# EAGLE design Tree_Batt (EAGLE 6.5.0)
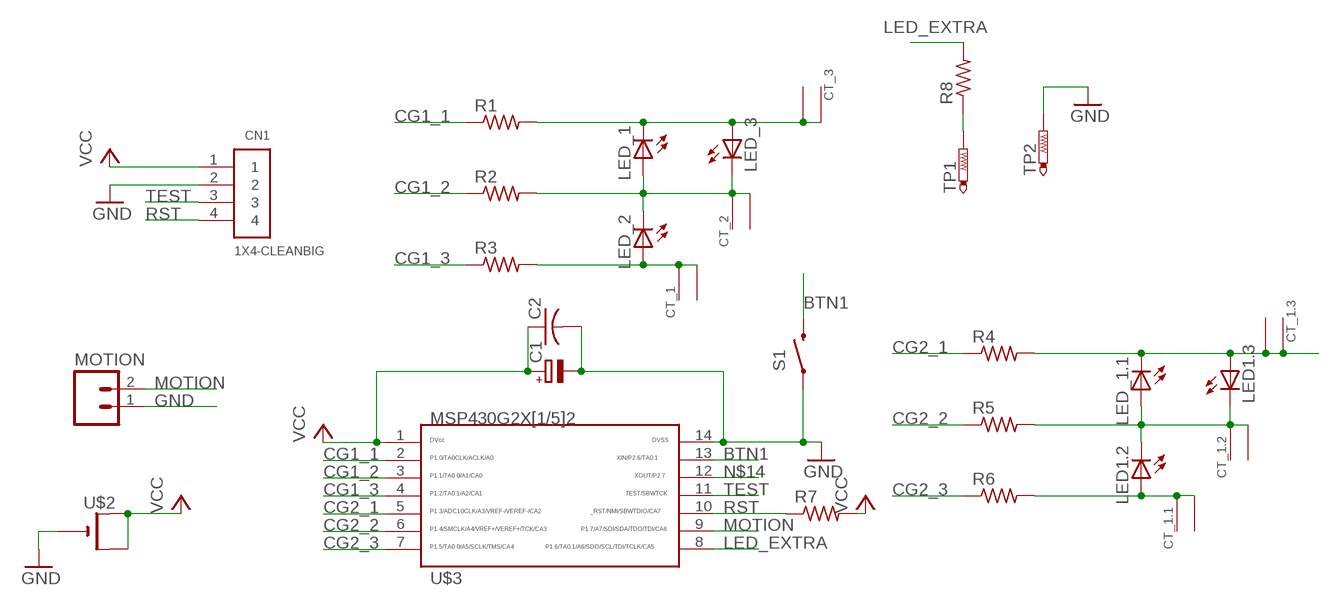
[diagram p0: schematic, sheet 1]

## Parts
C1  CPOL-EUE2,5-6E  [E2,5-6E]
C2  C-US025-024X044  [C025-024X044]
CN1  1X4-CLEANBIG  [1X04-CLEANBIG]
CT_1  SMD_PAD  [5X5TREEPAD]
CT_1.1  SMD_PAD  [5X5TREEPAD]
CT_1.2  SMD_PAD  [5X5TREEPAD]
CT_1.3  SMD_PAD  [5X5TREEPAD]
CT_2  SMD_PAD  [5X5TREEPAD]
CT_3  SMD_PAD  [5X5TREEPAD]
LED1.2  LEDLED_CLEAN_EDGE  [1X02_NO_SILK]
LED1.3  LEDLED_CLEAN_EDGE  [1X02_NO_SILK]
LED_1  LEDLED_CLEAN_EDGE  [1X02_NO_SILK]
LED_1.1  LEDLED_CLEAN_EDGE  [1X02_NO_SILK]
LED_2  LEDLED_CLEAN_EDGE  [1X02_NO_SILK]
LED_3  LEDLED_CLEAN_EDGE  [1X02_NO_SILK]
MOTION  M021X02_NO_SILK  [1X02_NO_SILK]
R1  R-US_0204/7  [0204/7]
R2  R-US_0204/7  [0204/7]
R3  R-US_0204/7  [0204/7]
R4  R-US_0204/7  [0204/7]
R5  R-US_0204/7  [0204/7]
R6  R-US_0204/7  [0204/7]
R7  R-US_0204/7  [0204/7]
R8  R-US_0204/7  [0204/7]
S1  SWITCH-MOMENTARY-2-SMD-1101NE  [TACTILE-SWITCH-1101NE]
TP1  PTR1PAD1-13  [P1-13]
TP2  PTR1PAD1-13  [P1-13]
U$2  CR2032SMT  [CR2032-SMD]
U$3  G2X[1/5]2---PW14  [PW14]

## Nets
BTN1: S1.P$2 U$3.13
CG1_1: R1.1 U$3.2
CG1_2: R2.1 U$3.3
CG1_3: R3.1 U$3.4
CG2_1: R4.1 U$3.5
CG2_2: R5.1 U$3.6
CG2_3: R6.1 U$3.7
GND: C1.- C2.2 CN1.2 MOTION.1 S1.P$1 TP2.TP U$2.- U$3.14
LED_EXTRA: R8.2 U$3.8
MOTION: MOTION.2 U$3.9
N$1: CT_1.P$1 CT_1.P$2 LED_2.1(A) R3.2
N$2: CT_2.P$1 CT_2.P$2 LED_1.1(A) LED_2.2(C) LED_3.2(C) R2.2
N$3: CT_3.P$1 CT_3.P$2 LED_1.2(C) LED_3.1(A) R1.2
N$4: R8.1 TP1.TP
N$5: CT_1.2.P$1 CT_1.2.P$2 LED1.2.2(C) LED1.3.2(C) LED_1.1.1(A) R5.2
N$6: CT_1.3.P$1 CT_1.3.P$2 LED1.3.1(A) LED_1.1.2(C) R4.2
N$7: CT_1.1.P$1 CT_1.1.P$2 LED1.2.1(A) R6.2
N$14: U$3.12
RST: CN1.4 R7.1 U$3.10
TEST: CN1.3 U$3.11
VCC: C1.+ C2.1 CN1.1 R7.2 U$2.+$1(+) U$2.+$2(+1) U$3.1

## Library data of the parts
C1 = rcl:CPOL-EU: POLARIZED CAPACITOR, European symbol
C2 = rcl:C-US: CAPACITOR, American symbol
CN1 = BergCustom:1X4: 4-pin connector
CT_1 CT_1.1-CT_1.3 CT_2 CT_3 = Christmas2014Custom:SMD_PAD
LED1.2 LED1.3 LED_1 LED_1.1 LED_2 LED_3 = BergCustom:LED: LED OSRAM: - CHIPLED LG R971, LG N971, LY N971, LG Q971, LY Q971, LO R971, LY R971 LH N974, LH R974 LS Q976, LO Q976, LY Q976 LO Q996 - Hyper CHIPLED LW Q18S LB Q993, LB Q99A, LB R99A - SideLED LS A670, LO A670, LY A670, LG A670, LP A670 LB A673, LV A673, LT A673, LW A673 LH A674 LY A675 LS A676, LA A676, LO A676, LY A676, LW A676 LS A679, LY A679, LG A679 - Hyper Micro SIDELED® LS Y876, LA Y876, LO Y876, LY Y876 LT Y87S - SmartLED LW L88C, LW L88S LB L89C, LB L89S, LG L890 LS L89K, LO L89K, LY L89K LS L896, LA L896, LO L896, LY L896 - TOPLED LS T670, LO T670, LY T670, LG T670, LP T670 LSG T670, LSP T670, LSY T670, LOP T670, LYG T670 LG T671, LOG T671, LSG T671 LB T673, LV T673, LT T673, LW T673 LH T674 LS T676, LA T676, LO T676, LY T676, LB T676, LH T676, LSB T676, LW T676 LB T67C, LV T67C, LT T67C, LS T67K, LO T67K, LY T67K, LW E67C LS E67B, LA E67B, LO E67B, LY E67B, LB E67C, LV E67C, LT E67C LW T67C LS T679, LY T679, LG T679 LS T770, LO T770, LY T770, LG T770, LP T770 LB T773, LV T773, LT T773, LW T773 LH T774 LS E675, LA E675, LY E675, LS T675 LS T776, LA T776, LO T776, LY T776, LB T776 LHGB T686 LT T68C, LB T68C - Hyper Mini TOPLED® LB M676 - Mini TOPLED Santana® LG M470 LS M47K, LO M47K, LY M47K Source: http://www.osram.convergy.de LUXEON: - LUMILED® LXK2-PW12-R00, LXK2-PW12-S00, LXK2-PW14-U00, LXK2-PW14-V00 LXK2-PM12-R00, LXK2-PM12-S00, LXK2-PM14-U00 LXK2-PE12-Q00, LXK2-PE12-R00, LXK2-PE12-S00, LXK2-PE14-T00, LXK2-PE14-U00 LXK2-PB12-K00, LXK2-PB12-L00, LXK2-PB12-M00, LXK2-PB14-N00, LXK2-PB14-P00, LXK2-PB14-Q00 LXK2-PR12-L00, LXK2-PR12-M00, LXK2-PR14-Q00, LXK2-PR14-R00 LXK2-PD12-Q00, LXK2-PD12-R00, LXK2-PD12-S00 LXK2-PH12-R00, LXK2-PH12-S00 LXK2-PL12-P00, LXK2-PL12-Q00, LXK2-PL12-R00 Source: www.luxeon.com KINGBRIGHT: KA-3528ASYC Source: www.kingbright.com
MOTION = BergCustom:M02: Header 2 Standard 2-pin 0.1" header. Use with straight break away headers (SKU : PRT-00116), right angle break away headers (PRT-00553), swiss pins (PRT-00743), machine pins (PRT-00117), and female headers (PRT-00115). Molex polarized connector foot print use with SKU : PRT-08233 with associated crimp pins and housings.
R1-R8 = rcl:R-US_: RESISTOR, American symbol
S1 = Sparkfun:SWITCH-MOMENTARY-2
TP1 TP2 = testpad:PTR1: TEST PIN
U$2 = adafruit:CR2032
U$3 = TI_MSP430_v16:G2X[1/5]2---PW14: MSP430G2X[1/5]2 MSP430G2x52, MSP430G2x12 TSSOP (PW) 14 Pin Package http://focus.ti.com/docs/prod/folders/print/msp430g2452.html

## Board
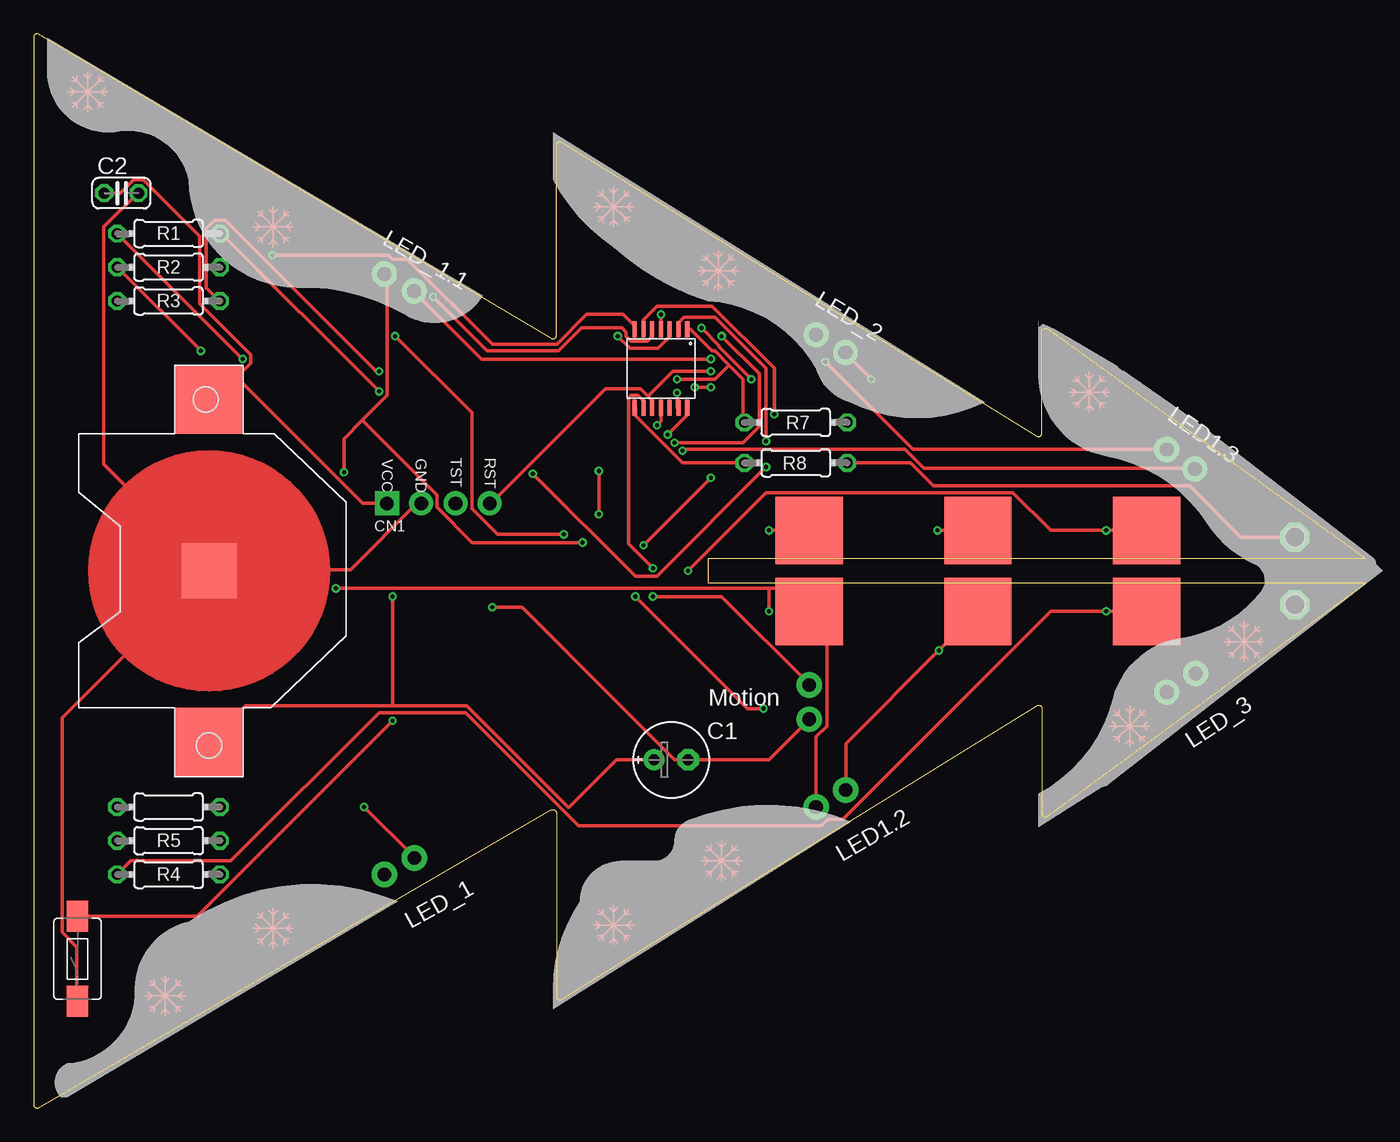
[diagram p1: board, top side]
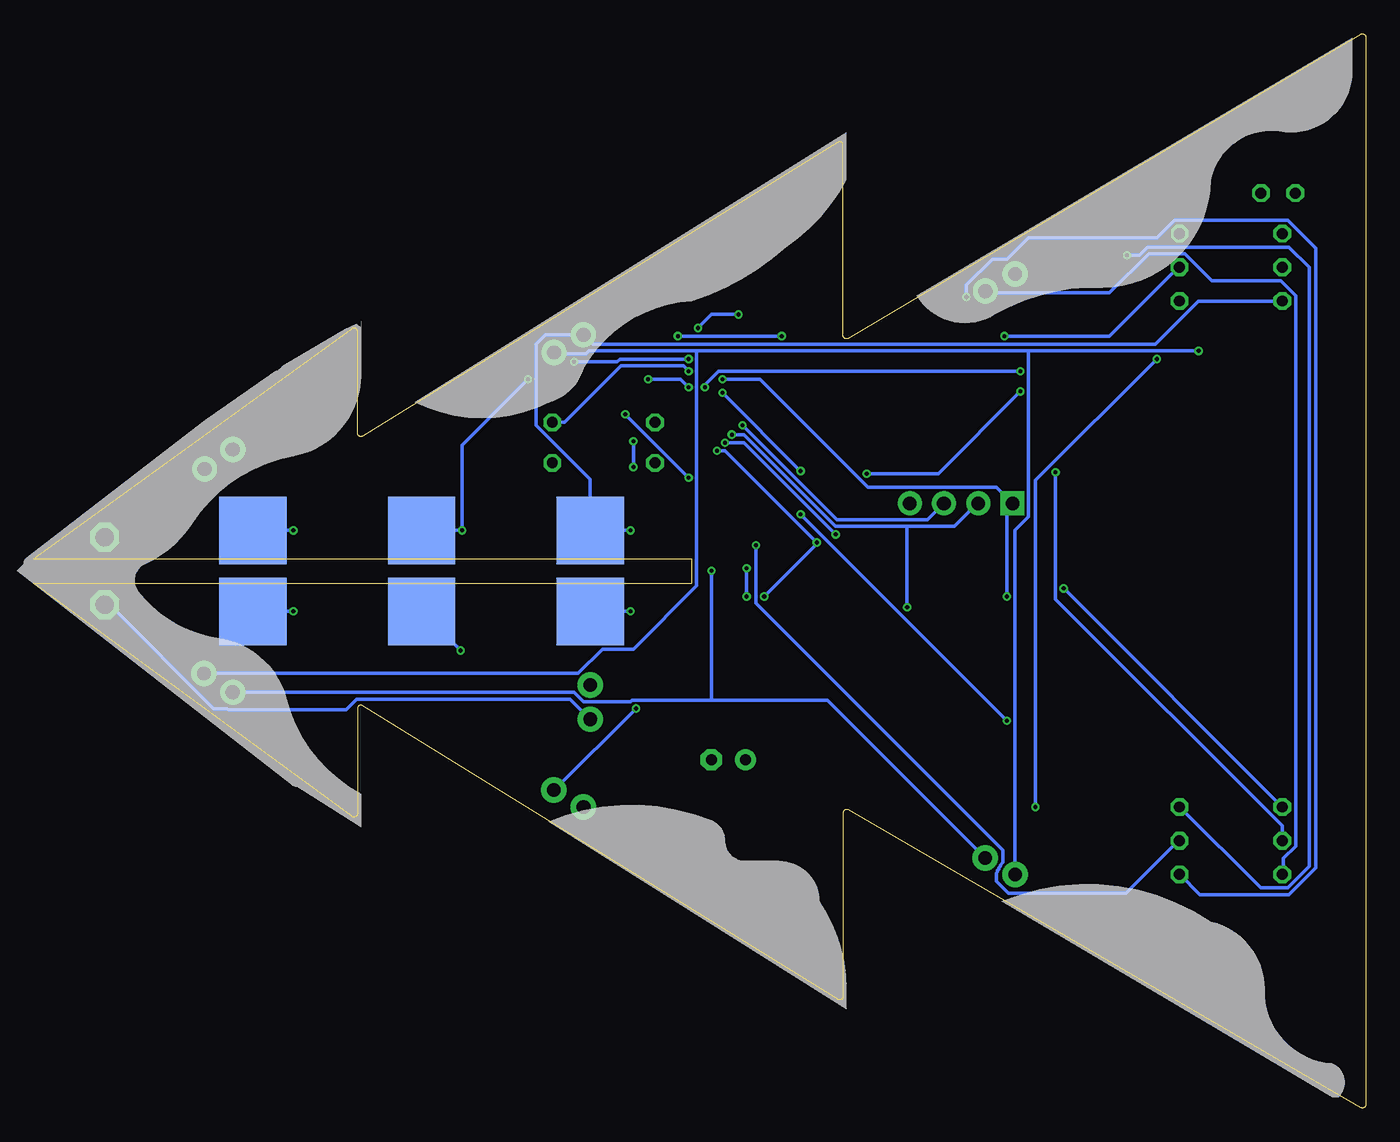
[diagram p2: board, bottom side, seen from below]

Size 98.75 x 79.62 mm. Coordinates in mm from the lower left corner, seen from the top.
Copper layers (1*16): Top 0.035mm / dielectric 1.5mm / Bottom 0.035mm
Design rules "Elecrow_2-layer_eagle_rule *": minimum track width 10mil, minimum drill 12mil, track to track 6mil, track to pad 6mil, pad to pad 6mil, via to via 6mil, smd to smd 0mil, copper to edge 10mil, drill to drill 10mil, minimum pad ring 10mil, minimum via ring 6mil, stop-mask expansion 2mil, vias tented up to drill 100mil, thermal gap 10mil

### Footprints (pad centres in the part's own frame; a part is rotated, then mirrored left to right if it is on the bottom)
E2,5-6E = drill 0.813 pad 1.575: + -1.27,0 | drill 0.813 pad 1.575 octagon: - 1.27,0
C025-024X044 = drill 0.813 octagon: 1 -1.27,0; 2 1.27,0
1X04-CLEANBIG = drill 1.016 pad 1.778 square: 1 -3.81,0 | drill 1.016 pad 1.778: 2 -1.27,0; 3 1.27,0; 4 3.81,0
5X5TREEPAD = smd 5 x 5: P$1 0,0 | smd 5 x 5 bottom: P$2 0,0
1X02_NO_SILK = drill 1.016 pad 1.88: 1 0,0; 2 2.54,0
0204/7 = drill 0.813 octagon: 1 -3.81,0; 2 3.81,0
TACTILE-SWITCH-1101NE = smd 2.3 x 1.6: P$1 -3.15,0; P$2 3.15,0
P1-13 = drill 1.321 pad 2.159 octagon: TP 0,0
CR2032-SMD = smd 5.08 x 5.08: +$1 -12.7,0; +$2 12.7,0 | smd 4.064 x 4.064: - 0,0
PW14 = smd 0.3 x 1.2: 1 -1.95,-2.9; 2 -1.3,-2.9; 3 -0.65,-2.9; 4 0,-2.9; 5 0.65,-2.9; 6 1.3,-2.9; 7 1.95,-2.9; 8 1.95,2.9; 9 1.3,2.9; 10 0.65,2.9; 11 0,2.9; 12 -0.65,2.9; 13 -1.3,2.9; 14 -1.95,2.9

### Placement (x,y rotation side)
C1  47.25,25.81 0 top
C2  6.5,67.81 0 top
CN1  30,44.81 0 top
CT_1  57.5,42.81 0 top
CT_1.1  57.5,36.81 0 top
CT_1.2  70,36.81 0 top
CT_1.3  82.5,36.81 0 top
CT_2  70,42.81 0 top
CT_3  82.5,42.81 0 top
LED1.2  58,22.31 30 top
LED1.3  84,48.81 325 top
LED_1  26,17.31 29 top
LED_1.1  26,61.81 330 top
LED_2  58,57.31 329 top
LED_3  84,30.81 33 top
MOTION  57.5,28.81 90 top
R1  10,64.81 180 top
R2  10,62.31 180 top
R3  10,59.81 180 top
R4  10,17.31 180 top
R5  10,19.81 180 top
R6  10,22.31 180 top
R7  56.5,50.81 180 top
R8  56.5,47.81 180 top
S1  3.25,11.06 90 top
TP1  93.5,42.31 0 top
TP2  93.5,37.31 0 top
U$1  [TREE_SHAPE]  0,79.81 270 top
U$2  13,39.81 90 top
U$3  46.5,54.81 180 top
U$4  [TREE_SNOW]  0,79.81 270 top
U$5  [SNOWFLAKE_1]  17.75,65.31 0 top
U$6  [SNOWFLAKE_1]  4,75.31 0 top
U$7  [SNOWFLAKE_1]  43,66.81 0 top
U$8  [SNOWFLAKE_1]  50.75,62.06 0 top
U$9  [SNOWFLAKE_1]  78.25,53.06 0 top
U$10  [SNOWFLAKE_1]  51,18.31 0 top
U$11  [SNOWFLAKE_1]  43,13.56 0 top
U$12  [SNOWFLAKE_1]  17.75,13.31 0 top
U$13  [SNOWFLAKE_1]  9.75,8.31 0 top
U$14  [SNOWFLAKE_1]  89.75,34.56 0 top
U$15  [SNOWFLAKE_1]  81.25,28.31 0 top

### Tracks (layer width: path | path; a pad name or v marks a point on that pad's centre or on a via)
BTN1  (via drill 0.3)
  Top 0.254: v47.7,53.01 47.7,51.91 U$3.13 | v41.9,44.01 v41.9,47.21 | v26.6,28.71 12.1,14.21 S1.P$2
  Bottom 0.254: v41.9,47.21 v47.7,53.01 | v26.6,28.71 v41.9,44.01
CG1_1  (via drill 0.3)
  Top 0.254: v54.3,49.41 54.3,54.81 50.5,58.61 48.2,58.61 47.8,58.21 47.8,57.81 U$3.2 | v54.3,47.51 46.2,39.41 44.6,39.41 v37,47.01 | v25.6,53.11 13.9,64.81 R1.1
  Bottom 0.254: v54.3,47.51 v54.3,49.41 | v37,47.01 31.7,47.01 v25.6,53.11
CG1_2  (via drill 0.3)
  Top 0.254: v43.3,57.21 44.2,56.31 46.3,56.31 47.1,57.11 47.1,57.71 U$3.3 | v51,57.21 53.8,54.41 53.8,50.51 52.6,49.31 v47.5,49.31 | v39.3,42.51 34.4,42.51 32.5,44.41 32.5,51.51 v26.8,57.21
  Bottom 0.254: v51,57.21 v43.3,57.21 | v47.5,49.31 46.1,49.31 v39.3,42.51 | v26.8,57.21 19,57.21 13.9,62.31 R2.1
CG1_3  (via drill 0.3)
  Top 0.254: v46.5,58.81 U$3.4 | v49.5,57.81 50.8,56.51 50.8,56.41 v53.2,54.01 | v49,53.41 v50.2,53.41 | v25.6,54.61 25.4,54.61 14.2,65.81 13.4,65.81 12.8,65.21 12.8,60.81 R3.1
  Bottom 0.254: v46.5,58.81 48.5,58.81 v49.5,57.81 | v53.2,54.01 50.8,54.01 v50.2,53.41 | v49,53.41 49,53.61 48,54.61 v25.6,54.61
CG2_1  (via drill 0.3)
  Top 0.254: v29.6,60.11 33.6,56.11 38.9,56.11 40.6,57.81 43.6,57.81 43.9,57.51 43.9,57.21 44.3,56.81 45.5,56.81 45.8,57.11 45.8,57.71 U$3.5
  Bottom 0.254: v29.6,60.11 29.6,61.01 27.7,62.91 26.6,62.91 25,64.51 15.5,64.51 14.2,65.81 5.8,65.81 3.7,63.71 3.7,17.81 5.7,15.81 12.3,15.81 R4.1
CG2_2  (via drill 0.3)
  Top 0.254: U$3.6 45.2,58.41 46.2,59.41 50.3,59.41 54.9,54.81 v54.9,51.41 | v45.2,41.71 v50.2,46.71
  Bottom 0.254: v50.2,46.71 v54.9,51.41 | v45.2,41.71 45.2,37.41 26.9,19.11 26.9,18.21 27.1,18.01 27.1,17.91 27.2,17.81 27.2,17.71 27.3,17.61 27.3,17.51 27.4,17.41 27.4,16.81 26.5,15.91 17.8,15.91 13.9,19.81 R5.1
CG2_3  (via drill 0.3)
  Top 0.254: v17.7,63.21 26.3,63.21 26.6,62.91 27.7,62.91 34,56.61 38.8,56.61 41,58.81 43.7,58.81 44.5,58.01 44.5,57.81 U$3.7
  Bottom 0.254: v17.7,63.21 16.8,63.21 16.2,63.81 5.7,63.81 4.2,62.31 4.2,17.91 5.8,16.31 7.8,16.31 R6.1
GND  (via drill 0.3)
  Top 0.254: v47,49.91 48.4,51.31 48.4,51.91 U$3.14 | U$2.- 2.1,28.91 2.1,13.01 3.2,11.91 3.2,7.91 S1.P$1 | C2.2 7.7,67.81 5.2,65.31 5.2,47.71 13,39.91 U$2.- | CN1.2 28.4,44.81 23.5,39.91 13.1,39.91 U$2.- | MOTION.1 54.5,25.81 C1.- 47.5,25.81 36.2,37.11 v34,37.11
  Bottom 0.254: TP2.TP 93.1,37.31 85.4,29.61 84.4,29.61 84.3,29.51 75.6,29.51 74.8,30.31 59,30.31 MOTION.1 | v47,49.91 46.1,49.91 39.3,43.11 34,43.11 | 34,43.11 30.5,43.11 28.8,44.81 CN1.2 | 34,43.11 v34,37.11
LED_EXTRA
  Top 0.254: R8.2 48.1,47.81 44.6,51.31 44.6,51.91 U$3.8
MOTION  (via drill 0.3)
  Top 0.254: U$3.9 45.2,52.41 44.8,52.81 44.3,52.81 44.1,52.61 44.1,41.81 v45.9,40.01 | v45.9,37.91 51,37.91 57.5,31.41 MOTION.2
  Bottom 0.254: v45.9,37.91 v45.9,40.01
N$1  (via drill 0.3)
  Top 0.254: v54.5,42.81 CT_1.P$2
  Bottom 0.254: v54.5,42.81 CT_1.P$2 57.5,46.61 61.5,50.61 61.5,56.61 60.8,57.31 LED_2.1 57.3,56.61 15.6,56.61 12.4,59.81 R3.2
N$2  (via drill 0.3)
  Top 0.254: v67,42.81 CT_2.P$2 | v12.4,56.11 R2.2 | v62.1,54.01 60.2,55.91 LED_2.2
  Bottom 0.254: CT_2.P$2 v67,42.81 67,49.11 v62.1,54.01 | 49.6,56.11 57.6,56.11 57.8,55.91 60.1,55.91 LED_2.2 | 49.6,56.11 25,56.11 | 25,56.11 v12.4,56.11 | LED_1.1 26,42.81 25,43.81 25,56.11 | 49.6,56.11 49.6,38.71 54.3,34.01 56.6,34.01 58.4,32.21 86.1,32.21 LED_3.2
N$3  (via drill 0.3)
  Top 0.254: CT_3.P$2 v79.5,42.81 75.4,42.81 72.6,45.61 54.3,45.61 v48.5,39.81 | v15.5,55.51 R1.2 | v24.5,22.31 28.2,18.61 LED_1.2
  Bottom 0.254: CT_3.P$2 v79.5,42.81 | v15.5,55.51 24.5,46.51 v24.5,22.31 | LED_3.1 58.7,30.81 58,30.11 54.5,30.11 54.4,30.21 48.5,30.21 | 48.5,30.21 39.9,30.21 28.3,18.61 LED_1.2 | 48.5,30.21 v48.5,39.81
N$4
  Top 0.254: R8.1 65,47.81 66.7,46.11 85.7,46.11 89.5,42.31 TP1.TP
N$5  (via drill 0.3)
  Top 0.254: CT_1.2.P$2 v67.1,33.91 60.2,27.01 60.2,23.61 LED1.2.2 | v23,47.11 23,49.61 24.35,50.96 | 24.35,50.96 26.2,52.81 26.2,61.61 LED_1.1.1 | v48.1,48.71 48.2,48.81 64.6,48.81 66,47.41 86,47.41 LED1.3.2 | v40.7,41.91 32.5,41.91 29.9,44.51 29.9,45.41 24.35,50.96 | v54.1,29.61 52.9,29.61 v44.6,37.91
  Bottom 0.254: v67.1,33.91 CT_1.2.P$2 | v23,47.11 23,37.71 6.2,20.91 R5.2 | v48.1,48.71 47.5,48.71 v40.7,41.91 40.7,41.81 v44.6,37.91 | v54.1,29.61 60.1,23.61 LED1.2.2
N$6  (via drill 0.3)
  Top 0.254: CT_1.3.P$2 v79.5,36.81 75.4,36.81 60,21.41 58.9,21.41 58.4,20.91 40.4,20.91 32,29.31 25.6,29.31 14.6,18.31 7.2,18.31 R4.2 | LED1.3.1 65.2,48.81 v58.7,55.31 | v50.2,55.51 33.2,55.51 28.2,60.51 LED_1.1.2
  Bottom 0.254: CT_1.3.P$2 v79.5,36.81 | R4.2 6.1,17.31 6.1,18.51 5.2,19.41 5.2,60.21 6.3,61.31 11.4,61.31 13.4,63.31 16.1,63.31 19,60.41 28,60.41 28.1,60.51 LED_1.1.2 | v58.7,55.31 55.5,55.31 55.3,55.51 v50.2,55.51
N$7  (via drill 0.3)
  Top 0.254: 54.5,38.51 55.8,38.51 CT_1.1.P$2 57.5,36.71 58.8,35.41 58.8,28.31 58,27.51 LED1.2.1 | 54.5,38.51 v22.4,38.51 | 54.5,38.51 v54.5,36.81
  Bottom 0.254: v22.4,38.51 R6.2 | v54.5,36.81 CT_1.1.P$2
RST  (via drill 0.3)
  Top 0.254: 45.55,52.76 45,53.31 42.4,53.31 33.9,44.81 CN1.4 | 45.55,52.76 45.8,52.51 45.8,51.91 U$3.10 | v50.2,54.61 47.4,54.61 45.55,52.76
  Bottom 0.254: R7.1 59.4,50.81 55.2,55.01 50.6,55.01 v50.2,54.61
TEST  (via drill 0.3)
  Top 0.254: U$3.11 46.5,50.91 v46.2,50.61
  Bottom 0.254: v46.2,50.61 39.2,43.61 32.5,43.61 31.3,44.81 CN1.3
VCC  (via drill 0.3)
  Top 0.254: 26.6,29.81 15.7,29.81 U$2.+$1 | 26.6,29.81 32.1,29.81 39.6,22.31 39.7,22.31 43.2,25.81 C1.+ | 51.55,55.06 52.6,54.01 52.6,50.81 R7.2 | 51.55,55.06 50.5,56.11 50.3,56.11 48.7,57.71 48.5,57.71 U$3.1 | C2.1 6.4,67.81 7.4,68.81 8.1,68.81 12.3,64.61 12.3,59.61 16.1,55.81 16.1,55.21 13.4,52.51 U$2.+$2 15.1,54.11 24.4,44.81 CN1.1 | 51.55,55.06 50.5,54.01 v47.7,54.01 | v26.6,37.91 26.6,29.81
  Bottom 0.254: v47.7,54.01 44.9,54.01 36.9,46.01 27.4,46.01 CN1.1 26.6,45.11 v26.6,37.91

### Text on the board
tPlace: Motion